# EAGLE design car2r0 (EAGLE 7.7.0)
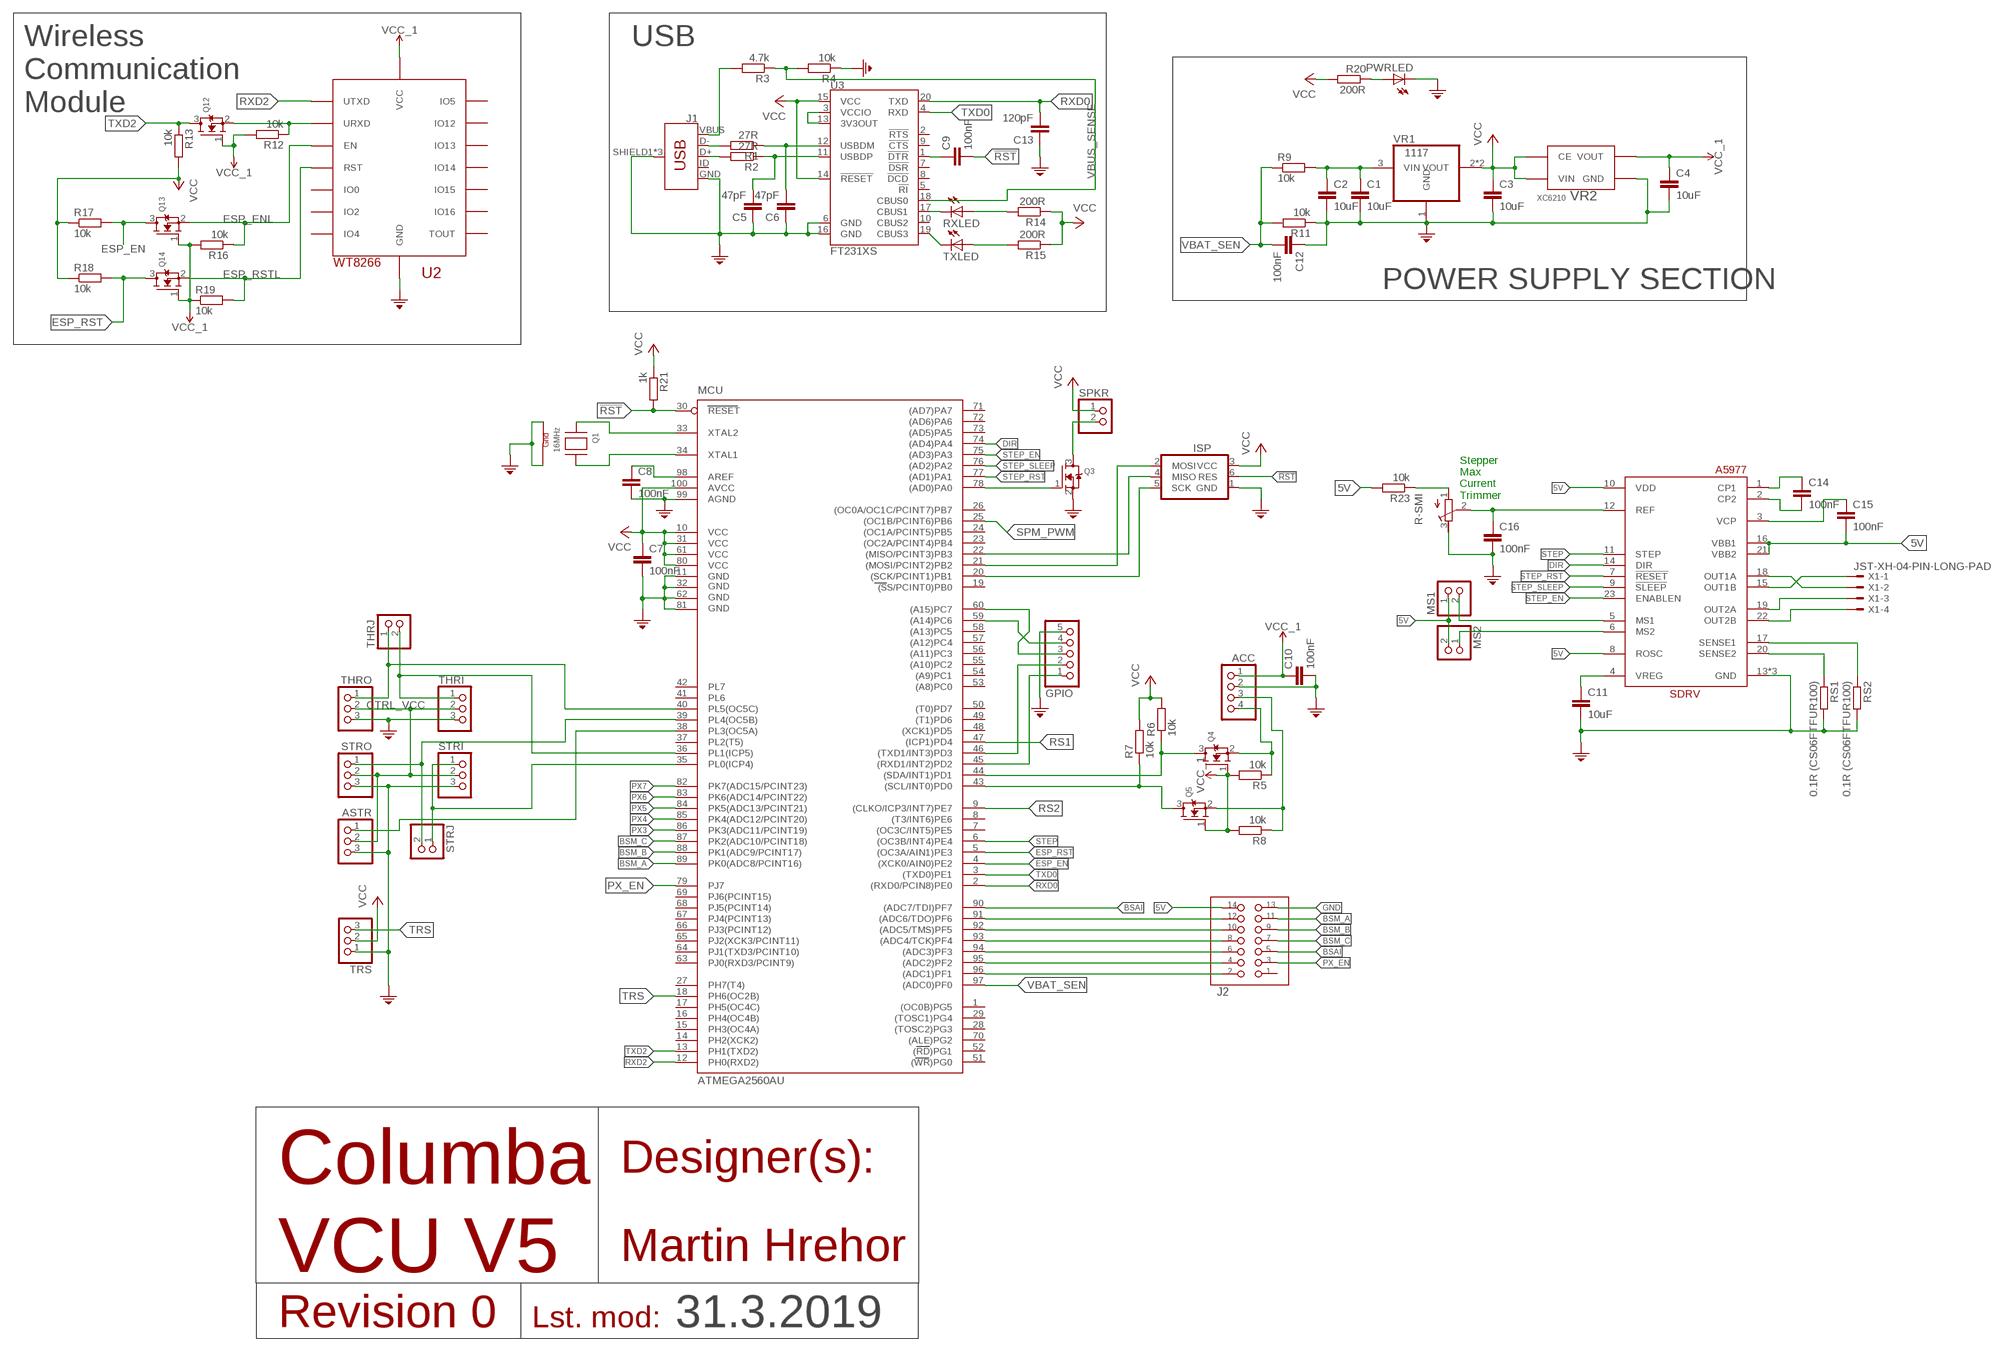
[diagram p0: schematic, sheet 1]

## Parts
ACC  PINHD-1X4/90  [1X04/90]
ASTR  PINHD-1X3  [1X03]
C1  10uF  C-EUC1206  [C1206]
C2  10uF  C-EUC1206  [C1206]
C3  10uF  C-EUC1206  [C1206]
C4  10uF  C-EUC1206  [C1206]
C5  47pF  C-EUC0603  [C0603]
C6  47pF  C-EUC0603  [C0603]
C7  100nF  C-EUC1206  [C1206]
C8  100nF  C-EUC1206  [C1206]
C9  100nF  C-EUC1206  [C1206]
C10  100nF  C-EUC1206  [C1206]
C11  10uF  C-EUC1206  [C1206]
C12  100nF  C-EUC1206  [C1206]
C13  120pF  C-EUC0603  [C0603]
C14  100nF  C-EUC1206  [C1206]
C15  100nF  C-EUC1206  [C1206]
C16  100nF  C-EUC1206  [C1206]
GPIO  PINHD-1X5  [1X05]
ISP  ISP  [ISP]
J1  USB_MICRO-B_FEMALE-SMT  [USB-B-MICRO-SMD]
J2  DS1014-14S  [DS1014-14S]
MCU  ATMEGA2560AU  [TQFP100]
MS1  PINHD-1X2  [1X02]
MS2  PINHD-1X2  [1X02]
PWRLED  LEDCHIP-LED0603  [CHIP-LED0603]
Q1  16MHz  XTAL-4-3225  [NX3225]
Q3  MOSFET-NREFLOW  [SOT23]
Q4  MOSFET-NREFLOW  [SOT23]
Q5  MOSFET-NREFLOW  [SOT23]
Q12  MOSFET-NREFLOW  [SOT23]
Q13  MOSFET-NREFLOW  [SOT23]
Q14  MOSFET-NREFLOW  [SOT23]
R1  27R  R-EU_R0603  [R0603]
R2  27R  R-EU_R0603  [R0603]
R3  4.7k  R-EU_R0603  [R0603]
R4  10k  R-EU_R0603  [R0603]
R5  10k  R-EU_R0603  [R0603]
R6  10k  R-EU_R0603  [R0603]
R7  10k  R-EU_R0603  [R0603]
R8  10k  R-EU_R0603  [R0603]
R9  10k  R-EU_R0805  [R0805]
R11  10k  R-EU_R0805  [R0805]
R12  10k  R-EU_R0603  [R0603]
R13  10k  R-EU_R0603  [R0603]
R14  200R  R-EU_R0603  [R0603]
R15  200R  R-EU_R0603  [R0603]
R16  10k  R-EU_R0603  [R0603]
R17  10k  R-EU_R0603  [R0603]
R18  10k  R-EU_R0603  [R0603]
R19  10k  R-EU_R0603  [R0603]
R20  200R  R-EU_R0603  [R0603]
R21  1k  R-EU_R0603  [R0603]
R23  10k  R-EU_R0603  [R0603]
R-SMI  R-TRIMM5W  [RTRIM5W]
RS1  0.1R (CS06FTFUR100)  R-EU_R1206  [R1206]
RS2  0.1R (CS06FTFUR100)  R-EU_R1206  [R1206]
RXLED  LEDCHIP-LED0603  [CHIP-LED0603]
SDRV  A4982LP  [TSSOP24P]
SPKR  PINHD-1X2  [1X02]
STRI  PINHD-1X3  [1X03]
STRJ  PINHD-1X2  [1X02]
STRO  PINHD-1X3  [1X03]
THRI  PINHD-1X3  [1X03]
THRJ  PINHD-1X2  [1X02]
THRO  PINHD-1X3  [1X03]
TRS  PINHD-1X3  [1X03]
TXLED  LEDCHIP-LED0603  [CHIP-LED0603]
U2  WT8266  [WT8266]
U3  FT231XS  [SSOP20_L]
VR1  1117  REG1117  [SOT223]
VR2  XC6210  [SOT25]
X1  JST-XH-04-PIN-LONG-PAD  [JST-XH-04-PACKAGE-LONG-PAD]

## Nets
3V3: ACC.1 C4.1 C10.1 Q4.1(G) Q5.1(G) Q12.1(G) Q13.1(G) Q14.1(G) R5.2 R8.2 R12.2 R16.2 R19.1 U2.3V3(VCC) VR2.5(VOUT) ; supply symbol labelled VCC_1
5V: C3.1 C7.1 C15.2 ISP.3(VCC) J2.P$14 MCU.10(VCC) MCU.31(VCC1) MCU.61(VCC2) MCU.80(VCC3) MCU.100(AVCC) MS1.1 MS2.2 R6.2 R7.2 R13.2 R14.1 R15.1 R17.1 R18.1 R20.2 R21.1 R23.2 SDRV.8(ROSC) SDRV.10(VDD) SDRV.16(VBB1) SDRV.21(VBB2) SPKR.1 TRS.2 U3.14(!RESET) U3.15(VCC) VR1.2(VOUT) VR1.4(VOUT) VR2.1(VIN) VR2.3(CE) ; supply symbol labelled VCC
!RST: C9.2 ISP.6(RES) MCU.30(RESET) R21.2
AREF: C8.1 MCU.98(AREF)
ASTR: ASTR.1 MCU.38(PL3(OC5A))
BSA0: J2.P$10 MCU.92((ADC5/TMS)PF5)
BSA1: J2.P$12 MCU.91((ADC6/TDO)PF6)
BSAI: J2.P$5 MCU.90((ADC7/TDI)PF7)
BSM_A: J2.P$11 MCU.89(PK0(ADC8/PCINT16))
BSM_B: J2.P$9 MCU.88(PK1(ADC9/PCINT17))
BSM_C: J2.P$7 MCU.87(PK2(ADC10/PCINT18))
CP1: C14.1 SDRV.1(CP1)
CP2: C14.2 SDRV.2(CP2)
CTRL_VCC: ASTR.2 STRI.2 STRO.2 THRI.2 THRO.2
DIR: MCU.74((AD4)PA4) SDRV.14(DIR)
DTR: C9.1 U3.1(!DTR)
ESP_EN: MCU.4((XCK0/AIN0)PE2) Q13.3(D) R17.2
ESP_ENL: Q13.2(S) R16.1 U2.EN
ESP_RST: MCU.5((OC3A/AIN1)PE3) Q14.3(D) R18.2
ESP_RSTL: Q14.2(S) R19.2 U2.RST
GND: ACC.2 ASTR.3 C1.2 C2.2 C3.2 C4.2 C5.1 C6.1 C7.2 C8.2 C10.2 C11.2 C12.1 C13.1 C16.2 GPIO.5 ISP.1(GND) J1.GND J1.SHIELD1(SHIELD) J1.SHIELD2(SHIELD) J1.SHIELD3(SHIELD) J2.P$13 MCU.11(GND) MCU.32(GND1) MCU.62(GND2) MCU.81(GND3) MCU.99(AGND) PWRLED.C Q1.2(G2) Q1.4(G1) Q3.2(S) R4.1 R11.1 R-SMI.3(E) RS1.2 RS2.2 SDRV.13(GND) SDRV.24(GND) SDRV.PAD(GND) STRI.3 STRO.3 THRI.3 THRO.3 TRS.1 U2.GND0(GND) U2.GND1(GND) U2.GND2(GND) U3.6(GND) U3.16(GND) VR1.1(GND) VR2.2(GND)
LX0: J2.P$2 MCU.96((ADC1)PF1)
LX1: J2.P$4 MCU.95((ADC2)PF2)
LX2: J2.P$6 MCU.94((ADC3)PF3)
LX3: J2.P$8 MCU.93((ADC4/TCK)PF4)
MISO: ISP.4(MISO) MCU.22((MISO/PCINT3)PB3)
MOSI: ISP.2(MOSI) MCU.21((MOSI/PCINT2)PB2)
MS1: MS1.2 SDRV.5(MS1)
MS2: MS2.1 SDRV.6(MS2)
N$1: MCU.33(XTAL2) Q1.1(X1)
N$2: MCU.34(XTAL1) Q1.3(X2)
N$3: GPIO.3 MCU.60((A15)PC7)
N$5: GPIO.2 MCU.46((TXD1/INT3)PD3)
N$6: GPIO.1 MCU.45((RXD1/INT2)PD2)
N$7: PWRLED.A R20.1
N$8: GPIO.4 MCU.59((A14)PC6)
N$10: R15.2 TXLED.A
N$11: R14.2 RXLED.A
OUT1A: SDRV.18(OUT1A) X1.2
OUT1B: SDRV.15(OUT1B) X1.1
OUT2A: SDRV.19(OUT2A) X1.3
OUT2B: SDRV.22(OUT2B) X1.4
PX3: MCU.86(PK3(ADC11/PCINT19))
PX4: MCU.85(PK4(ADC12/PCINT20))
PX5: MCU.84(PK5(ADC13/PCINT21))
PX6: MCU.83(PK6(ADC14/PCINT22))
PX7: MCU.82(PK7(ADC15/PCINT23))
PX_EN: J2.P$3 MCU.79(PJ7)
RS1: MCU.47((ICP1)PD4)
RS2: MCU.9((CLKO/ICP3/INT7)PE7)
RXD0: C13.2 MCU.2((RXD0/PCIN8)PE0) U3.20(TXD)
RXD2: MCU.12(PH0(RXD2)) U2.UTXD
RXLED: RXLED.C U3.17(CBUS1)
SCK: ISP.5(SCK) MCU.20((SCK/PCINT1)PB1)
SCL: MCU.43((SCL/INT0)PD0) Q5.3(D) R7.1
SCLL: ACC.3 Q5.2(S) R8.1
SDA: MCU.44((SDA/INT1)PD1) Q4.3(D) R6.1
SDAL: ACC.4 Q4.2(S) R5.1
SENSE1: RS2.1 SDRV.17(SENSE1)
SENSE2: RS1.1 SDRV.20(SENSE2)
SIV: R23.1 R-SMI.1(A)
SPKR: MCU.78((AD0)PA0) Q3.1(G)
SPKR0: Q3.3(D) SPKR.2
SPM_PWM: MCU.25((OC1B/PCINT6)PB6)
STEP: MCU.6((OC3B/INT4)PE4) SDRV.11(STEP)
STEP_EN: MCU.75((AD3)PA3) SDRV.23(ENABLEN)
STEP_RST: MCU.77((AD1)PA1) SDRV.7(!RESET)
STEP_SLEEP: MCU.76((AD2)PA2) SDRV.9(!SLEEP)
STRI: MCU.35(PL0(ICP4)) STRI.1 STRJ.1
STRO: MCU.39(PL4(OC5B)) STRJ.2 STRO.1
SVREF: C16.1 R-SMI.2(S) SDRV.12(REF)
THRI: MCU.36(PL1(ICP5)) THRI.1 THRJ.2
THRO: MCU.40(PL5(OC5C)) THRJ.1 THRO.1
TRS: MCU.18(PH6(OC2B)) TRS.3
TXD0: MCU.3((TXD0)PE1) U3.4(RXD)
TXD2: MCU.13(PH1(TXD2)) Q12.3(D) R13.1
TXLED: TXLED.C U3.19(CBUS3)
URXD: Q12.2(S) R12.1 U2.URXD
USBD+: J1.D+ R2.2
USBD-: J1.D- R1.2
USBDM: C6.2 R1.1 U3.12(USBDM)
USBDP: C5.2 R2.1 U3.11(USBDP)
VBAT_SEN: C12.2 MCU.97((ADC0)PF0) R9.1 R11.2
VBUS: J1.VBUS R3.2
VBUS_SENSE: R3.1 R4.2 U3.18(CBUS0)
VCCIO: U3.3(VCCIO) U3.13(3V3OUT)
VCP: C15.1 SDRV.3(VCP)
VIN: C1.1 C2.1 R9.2 VR1.3(VIN)
VREG: C11.1 SDRV.4(VREG)
Unconnected: J1.ID J2.P$1 MCU.1((OC0B)PG5) MCU.7((OC3C/INT5)PE5) MCU.8((T3/INT6)PE6) MCU.14(PH2(XCK2)) MCU.15(PH3(OC4A)) MCU.16(PH4(OC4B)) MCU.17(PH5(OC4C)) MCU.19((SS/PCINT0)PB0) MCU.23((OC2A/PCINT4)PB4) MCU.24((OC1A/PCINT5)PB5) MCU.26((OC0A/OC1C/PCINT7)PB7) MCU.27(PH7(T4)) MCU.28((TOSC2)PG3) MCU.29((TOSC1)PG4) MCU.37(PL2(T5)) MCU.41(PL6) MCU.42(PL7) MCU.48((XCK1)PD5) MCU.49((T1)PD6) MCU.50((T0)PD7) MCU.51((WR)PG0) MCU.52((RD)PG1) MCU.53((A8)PC0) MCU.54((A9)PC1) MCU.55((A10)PC2) MCU.56((A11)PC3) MCU.57((A12)PC4) MCU.58((A13)PC5) MCU.63(PJ0(RXD3/PCINT9)) MCU.64(PJ1(TXD3/PCINT10)) MCU.65(PJ2(XCK3/PCINT11)) MCU.66(PJ3(PCINT12)) MCU.67(PJ4(PCINT13)) MCU.68(PJ5(PCINT14)) MCU.69(PJ6(PCINT15)) MCU.70((ALE)PG2) MCU.71((AD7)PA7) MCU.72((AD6)PA6) MCU.73((AD5)PA5) U2.IO0 U2.IO2 U2.IO4 U2.IO5 U2.IO12 U2.IO13 U2.IO14 U2.IO15 U2.IO16 U2.TOUT U3.2(!RTS) U3.5(!RI) U3.7(!DSR) U3.8(!DCD) U3.9(!CTS) U3.10(CBUS2)

## Notes on the sheet
- USB
- Wireless
  Communication
  Module
- POWER SUPPLY SECTION
- Stepper
  Max
  Current
  Trimmer
- Columba | Designer(s):
- VCU V5 | Martin Hrehor
- Revision 0 | Lst. mod: | 31.3.2019

## Library data of the parts
ACC = pinhead:PINHD-1X4: PIN HEADER
ASTR STRI STRO THRI THRO TRS = adafruit:PINHD-1X3: PIN HEADER
C1-C16 = rcl:C-EU: CAPACITOR, European symbol
GPIO = pinhead:PINHD-1X5: PIN HEADER
ISP = custom:ISP
J1 = SparkFun-Connectors:USB_MICRO-B: USB Type Micro-B Connector Male/female and PTH/SMT variants SparkFun Products: SparkFun microB USB Breakout <https://www.sparkfun.com/products/12035> SparkFun USB microB Plug Breakout <https://www.sparkfun.com/products/10031> SparkFun ESP8266 Thing <https://www.sparkfun.com/products/13231>; PROD_ID: CONN-11752
J2 = columba:DS1014-14S
MCU = SparkFun-IC-Microcontroller:ATMEGA2560: Atmel 100-pin 8-bit uC 64/128/256 Kbytes FLASH 4 Kbytes EEPROM 8 Kbytes SRAM 86 General Purpose I/O pins 12-channels16-bit PWM 4 x Serial USARTs 16-channels 10-bit A/D SparkFun Products None.; PROD_ID: IC-10040
MS1 MS2 SPKR STRJ THRJ = pinhead:PINHD-1X2: PIN HEADER
PWRLED RXLED TXLED = adafruit:LED: LED OSRAM: - CHIPLED LG R971, LG N971, LY N971, LG Q971, LY Q971, LO R971, LY R971 LH N974, LH R974 LS Q976, LO Q976, LY Q976 LO Q996 - Hyper CHIPLED LW Q18S LB Q993, LB Q99A, LB R99A - SideLED LS A670, LO A670, LY A670, LG A670, LP A670 LB A673, LV A673, LT A673, LW A673 LH A674 LY A675 LS A676, LA A676, LO A676, LY A676, LW A676 LS A679, LY A679, LG A679 - Hyper Micro SIDELED® LS Y876, LA Y876, LO Y876, LY Y876 LT Y87S - SmartLED LW L88C, LW L88S LB L89C, LB L89S, LG L890 LS L89K, LO L89K, LY L89K LS L896, LA L896, LO L896, LY L896 - TOPLED LS T670, LO T670, LY T670, LG T670, LP T670 LSG T670, LSP T670, LSY T670, LOP T670, LYG T670 LG T671, LOG T671, LSG T671 LB T673, LV T673, LT T673, LW T673 LH T674 LS T676, LA T676, LO T676, LY T676, LB T676, LH T676, LSB T676, LW T676 LB T67C, LV T67C, LT T67C, LS T67K, LO T67K, LY T67K, LW E67C LS E67B, LA E67B, LO E67B, LY E67B, LB E67C, LV E67C, LT E67C LW T67C LS T679, LY T679, LG T679 LS T770, LO T770, LY T770, LG T770, LP T770 LB T773, LV T773, LT T773, LW T773 LH T774 LS E675, LA E675, LY E675, LS T675 LS T776, LA T776, LO T776, LY T776, LB T776 LHGB T686 LT T68C, LB T68C - Hyper Mini TOPLED® LB M676 - Mini TOPLED Santana® LG M470 LS M47K, LO M47K, LY M47K Source: http://www.osram.convergy.de/
Q1 = adafruit:XTAL-4: Classic 4-pin 3.2 x 2.5mm crystal
Q3-Q5 Q12-Q14 = adafruit:MOSFET-N: N-Channel Mosfet 2N7002E - 60V 260mA SOT23 [Digikey: 2N7002ET1GOSTR-ND] - REEL BSH103 - 30V 850mA SOT23 [Digikey: 568-5013-1-ND]
R1-R9 R11-R21 R23 RS1 RS2 = custom:R-EU_: RESISTOR, European symbol
R-SMI = resistor:R-TRIMM: Trimm resistor
SDRV = columba:A4982
U2 = custom:WT8266
U3 = SparkFun-IC-Comms:FT231X: FTDI FT231X Full Speed USB to Full-handshake UART This USB2.0 Full Speed IC offers a compact bridge to full handshake UART interfaces. The device is a UART, capable of operating up to 3MBaud, with low power consumption (8mA). The FT231X includes the complete FT-X series feature set and enables USB to be added into a system design quickly and easily over a UART interface. Datasheet <http://cdn.sparkfun.com/datasheets/Components/General%20IC/DS_FT231X.pdf> SparkFun Products SparkFun RedBoard - Programmed with Arduino <https://www.sparkfun.com/products/12757> (DEV-12757) SparkFun XBee Explorer USB <https://www.sparkfun.com/products/11812> (WRL-11812) SparkFun XBee Explorer Dongle <https://www.sparkfun.com/products/11697> (WRL-11697) SparkFun Blynk Board - ESP8266 <https://www.sparkfun.com/products/13794> (WRL-13794) SparkFun ESP8266 Thing - Dev Board <https://www.sparkfun.com/products/13711> (WRL-13711) SparkFun Block for Intel® Edison - Base <https://www.sparkfun.com/products/13045> (DEV-13045) SparkFun RedStick <https://www.sparkfun.com/products/13741> (DEV-13741) SparkFun Beefy 3 - FTDI Basic Breakout <https://www.sparkfun.com/products/13746> (DEV-13746) SparkFun FT231X Breakout <https://www.sparkfun.com/products/11736> (BOB-11736); PROD_ID: IC-11524
VR1 = burr-brown:REG1117: 800mA and 1A Low Dropout (LDO) Positive Regulator 1.8V, 2.5V, 2.85V, 3.3V, 5V, and Adj; MPN: REG1117; OC_FARNELL: 1097566; OC_NEWARK: 14P6981
VR2 = custom:XC6210
X1 = Rembrandt Electronics - JST XH Connectors v1-0:JST-XH-04-PIN: JST XH Connector 2 Pin Wire to board connector. Pitch: 2,54 mm, (0.100") Number of pins: 4 Created by Rembrandt Electronics www.rembrandtelectronics.com

## Board
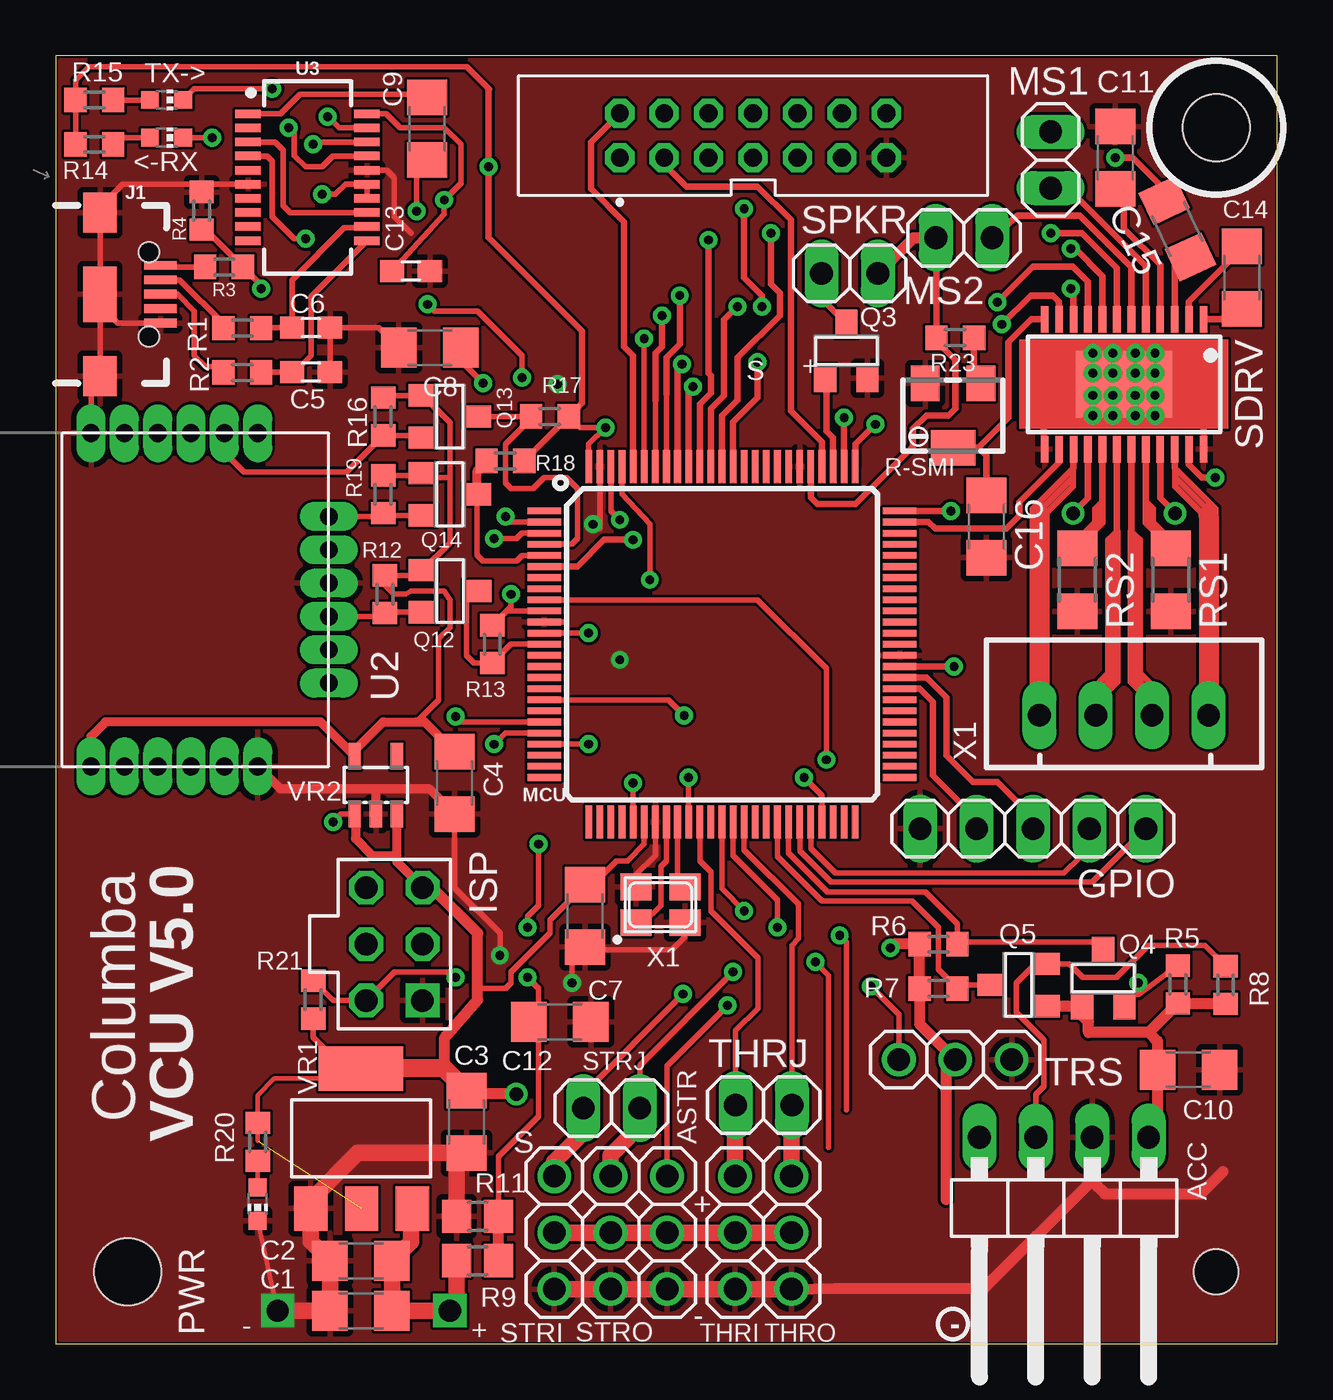
[diagram p1: board, top side]
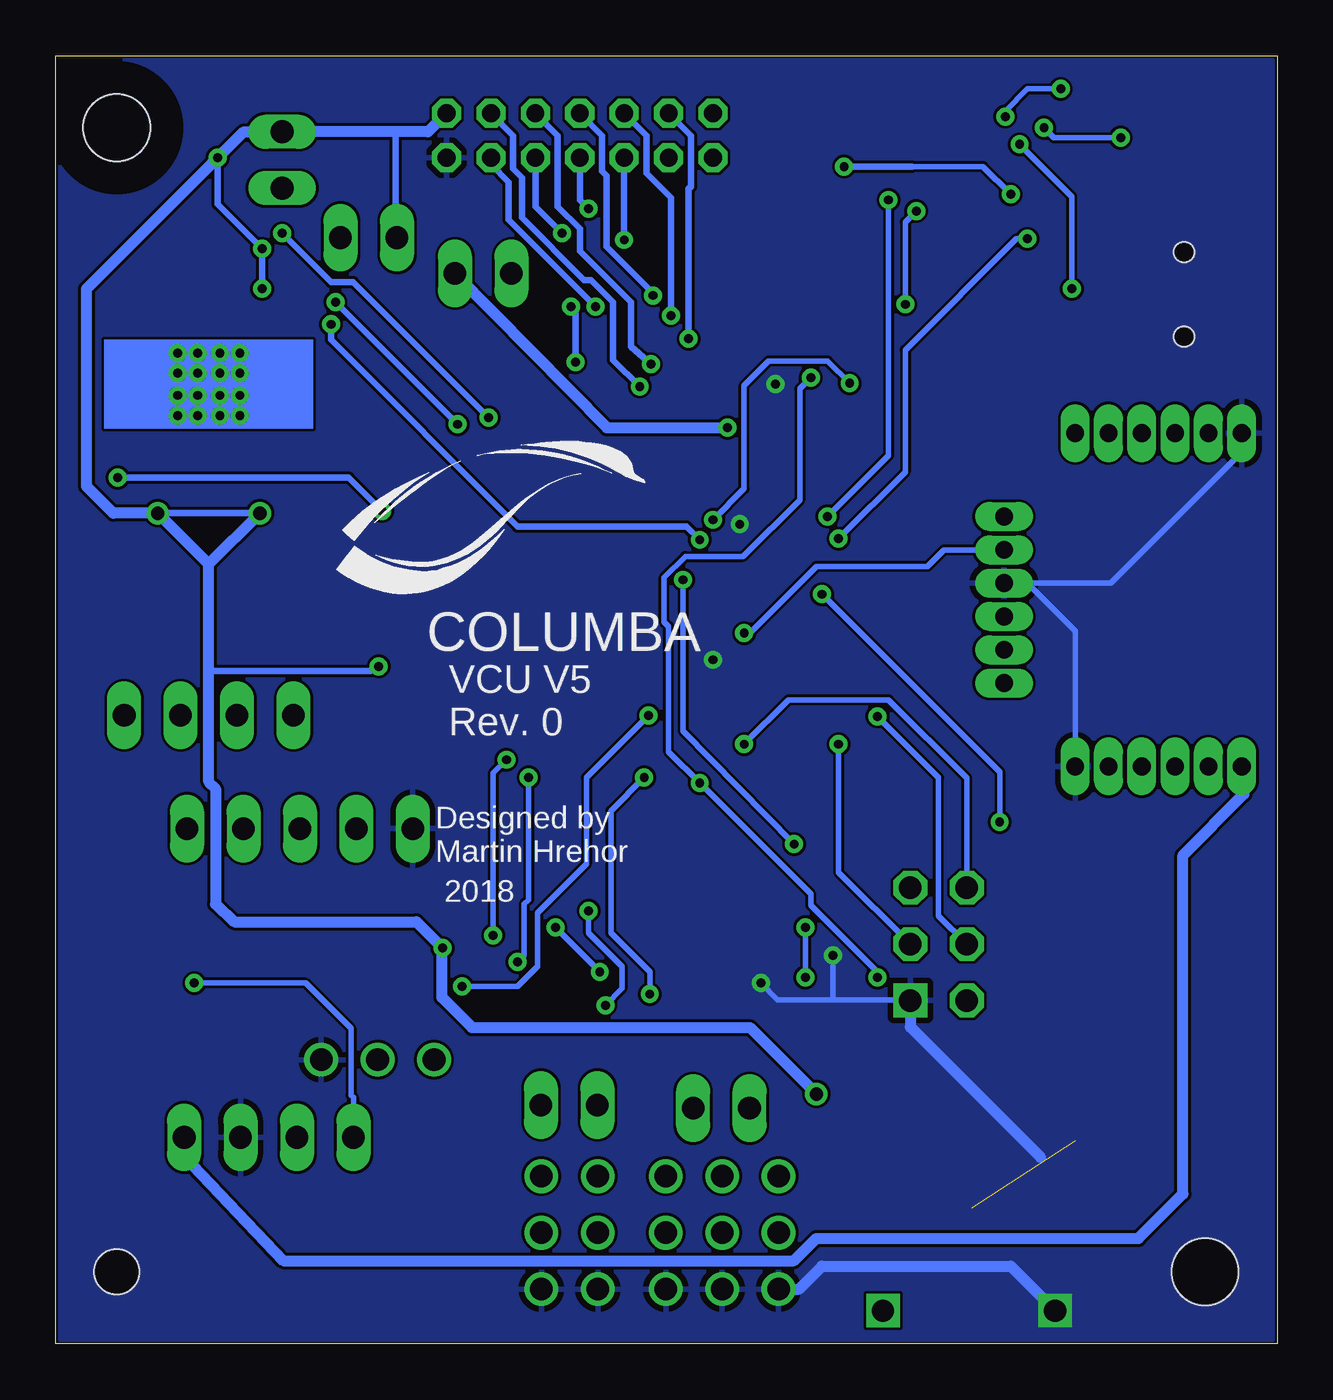
[diagram p2: board, bottom side, seen from below]

Size 55 x 58 mm. Coordinates in mm from the lower left corner, seen from the top.
Outline: 0,0 55,0 55,58 0,58 0,0
Copper layers (1*16): Top 0.035mm / dielectric 1.5mm / Bottom 0.035mm
Design rules "jlcpcb": minimum track width 5mil, minimum drill 0.3mm, track to track 5mil, track to pad 5mil, pad to pad 5mil, via to via 5mil, smd to smd 5mil, copper to edge 0mil, drill to drill 5mil, minimum pad ring 10mil, minimum via ring 8mil, stop-mask expansion 4mil, vias tented up to drill 0mil, thermal gap 10mil
Holes 3 mm at 3.25,3.25 52.25,54.75
Holes 2 mm at 52.25,3.25
tRestrict: area 49.2,51.8 to 55.2,57.8
bRestrict: area 49.2,51.8 to 55.2,57.8

### Footprints (pad centres in the part's own frame; a part is rotated, then mirrored left to right if it is on the bottom)
1X04/90 = drill 1.016 long: 1 -3.81,-3.81; 2 -1.27,-3.81; 3 1.27,-3.81; 4 3.81,-3.81
1X03 = drill 1.016: 1 -2.54,0; 2 0,0; 3 2.54,0
C1206 = smd 1.6 x 1.8: 1 -1.4,0; 2 1.4,0
C0603 = smd 1.1 x 1: 1 -0.85,0; 2 0.85,0
1X05 = drill 1.016 long: 1 -5.08,0; 2 -2.54,0; 3 0,0; 4 2.54,0; 5 5.08,0
ISP = drill 1.016 square: 1 -2.54,-1.27 | drill 1.016 octagon: 2 0,-1.27; 3 2.54,-1.27; 4 2.54,1.27; 5 0,1.27; 6 -2.54,1.27
USB-B-MICRO-SMD = smd 1.45 x 0.4: D+ 2.725,0; D- 2.725,0.65; GND 2.725,-1.3; ID 2.725,-0.65; VBUS 2.725,1.3 | smd 1.5 x 1.8: SHIELD1 0,3.685; SHIELD2 0,-3.685 | smd 1.5 x 2.5: SHIELD3 0,0 | hole 0.9: 2.2,1.9; 2.2,-1.9
DS1014-14S = drill 0.8 pad 1.27 octagon: P$1 6,1; P$2 6,-1; P$3 4,1; P$4 4,-1; P$5 2,1; P$6 2,-1; P$7 0,1; P$8 0,-1; P$9 -2,1; P$10 -2,-1; P$11 -4,1; P$12 -4,-1; P$13 -6,1; P$14 -6,-1
TQFP100 = smd 1.5 x 0.3: 1 -8,6; 2 -8,5.5; 3 -8,5; 4 -8,4.5; 5 -8,4; 6 -8,3.5; 7 -8,3; 8 -8,2.5; 9 -8,2; 10 -8,1.5; 11 -8,1; 12 -8,0.5; 13 -8,0; 14 -8,-0.5; 15 -8,-1; 16 -8,-1.5; 17 -8,-2; 18 -8,-2.5; 19 -8,-3; 20 -8,-3.5; 21 -8,-4; 22 -8,-4.5; 23 -8,-5; 24 -8,-5.5; 25 -8,-6; 51 8,-6; 52 8,-5.5; 53 8,-5; 54 8,-4.5; 55 8,-4; 56 8,-3.5; 57 8,-3; 58 8,-2.5; 59 8,-2; 60 8,-1.5; 61 8,-1; 62 8,-0.5; 63 8,0; 64 8,0.5; 65 8,1; 66 8,1.5; 67 8,2; 68 8,2.5; 69 8,3; 70 8,3.5; 71 8,4; 72 8,4.5; 73 8,5; 74 8,5.5; 75 8,6 | smd 0.3 x 1.5: 26 -6,-8; 27 -5.5,-8; 28 -5,-8; 29 -4.5,-8; 30 -4,-8; 31 -3.5,-8; 32 -3,-8; 33 -2.5,-8; 34 -2,-8; 35 -1.5,-8; 36 -1,-8; 37 -0.5,-8; 38 0,-8; 39 0.5,-8; 40 1,-8; 41 1.5,-8; 42 2,-8; 43 2.5,-8; 44 3,-8; 45 3.5,-8; 46 4,-8; 47 4.5,-8; 48 5,-8; 49 5.5,-8; 50 6,-8; 76 6,8; 77 5.5,8; 78 5,8; 79 4.5,8; 80 4,8; 81 3.5,8; 82 3,8; 83 2.5,8; 84 2,8; 85 1.5,8; 86 1,8; 87 0.5,8; 88 0,8; 89 -0.5,8; 90 -1,8; 91 -1.5,8; 92 -2,8; 93 -2.5,8; 94 -3,8; 95 -3.5,8; 96 -4,8; 97 -4.5,8; 98 -5,8; 99 -5.5,8; 100 -6,8
1X02 = drill 1.016 long: 1 -1.27,0; 2 1.27,0
CHIP-LED0603 = smd 0.8 x 0.8: A 0,-0.75; C 0,0.75
NX3225 = smd 1.4 x 1.2: 1 -1.1,-0.8; 2 1.1,-0.8; 3 1.1,0.8; 4 -1.1,0.8
SOT23 = smd 1 x 1.27: 1 -0.95,-1.227; 2 0.95,-1.227; 3 0,1.227
R0603 = smd 1 x 1.1: 1 -0.85,0; 2 0.85,0
R0805 = smd 1.3 x 1.5: 1 -0.95,0; 2 0.95,0
RTRIM5W = smd 1.3 x 1.6: 1 -1.25,-1.45; 3 1.25,-1.45 | smd 2 x 1.6: 2 0,1.45
R1206 = smd 1.6 x 1.803: 1 -1.422,0; 2 1.422,0
TSSOP24P = smd 0.35 x 1.2: 1 -3.575,-2.925; 2 -2.925,-2.925; 3 -2.275,-2.925; 4 -1.625,-2.925; 5 -0.975,-2.925; 6 -0.325,-2.925; 7 0.325,-2.925; 8 0.975,-2.925; 9 1.625,-2.925; 10 2.275,-2.925; 11 2.925,-2.925; 12 3.575,-2.925; 13 3.575,2.925; 14 2.925,2.925; 15 2.275,2.925; 16 1.625,2.925; 17 0.975,2.925; 18 0.325,2.925; 19 -0.325,2.925; 20 -0.975,2.925; 21 -1.625,2.925; 22 -2.275,2.925; 23 -2.925,2.925; 24 -3.575,2.925 | smd 4.32 x 3: PAD 0,0
WT8266 = drill 0.8 pad 0.9 long: 3V3 -7.5,1.4; EN 7.5,-4.6; GND0 -7.5,-6.1; GND1 0.75,-9.3; GND2 7.5,1.4; IO0 -7.5,-1.6; IO2 -7.5,-3.1; IO4 -7.5,-0.1; IO5 -2.25,-9.3; IO12 7.5,-1.6; IO13 -3.75,-9.3; IO14 7.5,-0.1; IO15 -7.5,-4.6; IO16 7.5,-3.1; RST 3.75,-9.3; TOUT 7.5,-6.1; URXD -0.75,-9.3; UTXD 2.25,-9.3
SSOP20_L = smd 0.381 x 1.143: 1 -2.857,-2.68; 2 -2.223,-2.68; 3 -1.587,-2.68; 4 -0.953,-2.68; 5 -0.318,-2.68; 6 0.318,-2.68; 7 0.953,-2.68; 8 1.587,-2.68; 9 2.223,-2.68; 10 2.857,-2.68; 11 2.857,2.68; 12 2.223,2.68; 13 1.587,2.68; 14 0.953,2.68; 15 0.318,2.68; 16 -0.318,2.68; 17 -0.953,2.68; 18 -1.587,2.68; 19 -2.223,2.68; 20 -2.857,2.68
SOT223 = smd 1.499 x 2.007: 1 -2.261,-3.15; 2 0.025,-3.15; 3 2.311,-3.15 | smd 3.81 x 2.007: 4 0,3.15
SOT25 = smd 0.55 x 1.2: 1 -0.95,-1.3; 2 0,-1.3; 3 0.95,-1.3; 4 0.95,1.3; 5 -0.95,1.3
JST-XH-04-PACKAGE-LONG-PAD = drill 1.016 long: 1 -3.81,0; 2 -1.27,0; 3 1.27,0; 4 3.81,0

### Placement (x,y rotation side)
ACC  45.4,5.49 180 top
ASTR  27.53,5.01 270 top
C1  13.75,1.5 180 top
C2  13.75,3.75 180 top
C3  18.5,10 270 top
C4  17.96,25.25 270 top
C5  11.5,43.75 180 top
C6  11.5,45.75 180 top
C7  23.83,19.27 270 top
C8  16.85,44.84 180 top
C9  16.73,54.71 270 top
C10  51,12.35 0 top
C11  47.7,53.4 90 top
C12  22.7,14.5 180 top
C13  16,48.3 180 top
C14  53.4,48 90 top
C15  50.5,50.2 115 top
C16  41.9,36.8 270 top
GPIO  44,23.2 180 top
ISP  15.25,18 90 top
J1  2,47.25 0 top
J2  31.4,54.4 180 top
MCU  30,31.5 0 top
MS1  44.8,53.3 270 top
MS2  40.9,49.8 180 top
PWRLED  9.1,6.3 180 top
Q1  27.23,19.77 0 top
Q3  35.6,44.7 0 top
Q4  47.16,16.47 0 top
Q5  43.35,16.16 90 top
Q12  17.76,33.89 270 top
Q13  17.75,41.75 270 top
Q14  17.75,38.25 270 top
R1  8.41,45.73 180 top
R2  8.41,43.73 180 top
R3  7.59,48.48 180 top
R4  6.58,51.01 270 top
R5  50.52,16.18 270 top
R6  39.75,18 180 top
R7  39.75,16 180 top
R8  52.67,16.16 270 top
R9  19,3.75 180 top
R11  19,5.75 0 top
R12  14.83,33.75 90 top
R13  19.66,31.5 90 top
R14  1.75,54 0 top
R15  1.75,56 0 top
R16  14.75,41.75 90 top
R17  22.25,41.75 180 top
R18  20.25,39.75 180 top
R19  14.75,38.25 270 top
R20  9.1,9.1 90 top
R21  11.6,15.5 90 top
R23  40.5,45.3 180 top
R-SMI  40.4,41.8 180 top
RS1  50.2,34.4 270 top
RS2  46,34.4 270 top
RXLED  5,54.3 270 top
SDRV  48.1,43.2 180 top
SPKR  35.75,48.19 180 top
STRI  22.45,5.01 270 top
STRJ  25.03,10.61 0 top
STRO  24.99,5.01 270 top
THRI  30.59,5.01 270 top
THRJ  31.88,10.76 180 top
THRO  33.13,5.01 270 top
TRS  40.5,12.8 180 top
TXLED  5,56 270 top
U2  3,33.5 90 top
U3  11.34,52.52 270 top
VR1  13.75,9.25 0 top
VR2  14.42,25.16 0 top
X1  48.1,28.3 0 top

### Tracks (layer width: path | path; a pad name or v marks a point on that pad's centre or on a via)
3V3
  Top 0.25: R19.1 16.42,39.1 Q14.1 16.8,39.2 17,39 17.75,39 | R16.2 14.85,42.7 Q13.1 17.75,41.47 17.75,39 | 17.75,39 17.75,36.06 Q12.1 16.29,34.6 R12.2 14.83,34.17 15.25,33.75 15.75,33.75 16,33.9 17.5,33.9 17.75,33.5 17.75,32.25 17.25,31.75 17.25,29 16.25,28
  Top 0.4: C4.1 16.61,28 16.25,28 14.75,28 13.47,26.72 VR2.5 11.93,28 2.25,28 1.6,27.35 U2.3V3
  Top 0.5: 49.21,14.02 R5.2 52.65,15.33 R8.2 | Q5.1 46.18,15.21 Q4.1 46.21,14.79 46.5,14.5 46.5,14.02 49.21,14.02 | 49.21,9.78 ACC.1 49.6,9.69 C10.1 49.6,13.63 49.21,14.02
  Bottom 0.5: U2.3V3 1.5,25.9 1.5,24.75 4.25,22 4.25,6.75 6.25,4.75 20.75,4.75 21.75,3.75 44.75,3.75 49.25,8.5 49.25,9.26 ACC.1
5V  (via drill 0.4, 0.4 pad 0.6, 0.6, 0.6 pad 0.8)  (1 unrouted)
  Top 0.2: 9.1,9.15 R20.2 9.1,11.2 9.85,11.95 12.55,11.95
  Top 0.25: MCU.31 26.5,22.5 25.75,21.75 25.25,21.75 24.17,20.67 C7.1 22.25,19.09 22.25,18.5 20.5,16.75 20.5,16.25 20.25,16 19,16 | MCU.100 24,40.5 v24.75,41.25 23.6,41.25 R17.1 R18.1 | R14.1 R15.1 0.9,56.9 1.5,57.5 18.5,57.5 19.51,56.49 | MCU.10 20.31,33 R13.2 20.5,33.19 v20.5,33.75 | v12.5,23.5 12.86,23.86 VR2.1 | v12,51.75 12.6,51.75 13.05,52.2 U3.15 U3.14 | R21.1 11.6,13.8 13.38,12.03
  Top 0.3: MCU.61 v40.45,30.5 | SDRV.16 46.48,38.08 v45.8,37.4 | SDRV.21 49.73,38.08 v50.4,37.4 | SDRV.8 47.12,48.08 45.9,49.3 v45.7,49.3 | v45.7,47.5 45.83,47.38 SDRV.10 | C15.2 49.62,52.28 48.5,53.4 v47.7,53.4 | MS2.2 39.65,49.78 R23.2 39.65,45.15 40.5,44.3 40.5,42.1 40.2,41.8 39.2,41.8 38.6,41.2 38.6,40.4 36,37.8 34.3,37.8 34,38.1 MCU.80 | 19.51,56.49 19.5,56.48 v19.5,53 19.5,49.8 23.7,45.6 23.7,42.35 R17.1
  Top 0.4: ISP.3 15.37,21.69 15.37,22 | 15.37,22 VR2.3 | VR2.1 13.5,23.83 13.5,22.75 14.25,22 15.37,22
  Top 0.5: 17.5,13.75 19,15.5 19,16 19,18.5 16.96,20.54 ISP.3 | v20.75,11.25 18.65,11.25 C3.1 | v37.58,17.82 37.75,18 R6.2 38.9,16.35 39.05,16.2 R7.2 38.9,14.4 TRS.2 40.1,12.4 40.1,6.5 | 17.5,13.75 | 17.5,13.75 17.5,12.4 | 39.65,49.78 38.61,49.78 SPKR.1
  Top 0.75: 13.38,12.03 VR1.4
  Top 0.813: 12.4,11.8 12.55,11.95 13,12.4 VR1.4 17.5,12.4 C3.1
  Bottom 0.25: 25,41.25 v24.75,41.25 | v20.5,33.75 12.5,25.75 v12.5,23.5 | v12,51.75 13.25,53 16.45,53
  Bottom 0.3: v40.45,30.5 40.82,30.3 48,30.3 48.1,30.4 | v50.4,37.4 v45.8,37.4 | v45.7,47.5 v45.7,49.3 47.7,51.3 v47.7,53.4 | MS2.2 39.7,49.87 39.7,54.57 | 16.45,53 v19.5,53
  Bottom 0.5: v20.75,11.25 23.75,14.25 36.25,14.25 37.6,15.6 37.6,17.85 | v37.58,17.82 37.6,17.85 | 37.6,17.85 38.75,19 46.95,19 47.8,19.8 47.8,25 48.1,25.3 48.1,30.4 48.1,35.1 | 48.1,35.1 v45.8,37.4 | 48.1,35.1 v50.4,37.4 52.4,37.4 53.6,38.6 53.6,47.5 v47.7,53.4 46.53,54.57 MS1.1 39.7,54.57 38.23,54.57 J2.P$14 | SPKR.1 30.18,41.25 v24.75,41.25
!RST  (via drill 0.4 pad 0.6)
  Top 0.25: v18,16.5 17.75,16.75 15.27,16.75 ISP.6 12.49,15.46 R21.2 | C9.2 16.25,52.83 v16.25,51 | v16.75,46.8 17.05,46.5 19,46.5 21,44.5 v21,43.5 | v26,25.25 MCU.30
  Bottom 0.25: v18,16.5 18,16.75 21,19.75 21,20.25 v26,25.25 27.4,26.65 27.4,32.3 27.6,32.5 27.6,34.5 26.65,35.45 24.05,35.45 21.5,38 21.5,43 v21,43.5 | v16.25,51 16.75,50.5 v16.75,46.8
AREF  (via drill 0.4 pad 0.6)
  Top 0.25: MCU.98 25,37.5 v25.4,37.1 | v19.25,43.25 18.25,44.25 C8.1
  Bottom 0.25: v25.4,37.1 24,38.5 24,43.15 22.9,44.25 20.25,44.25 v19.25,43.25
ASTR  (via drill 0.4 pad 0.6)
  Top 0.25: v31,19.5 30,20.5 MCU.38 | ASTR.1 27.53,12.53 v30.25,15.25
  Bottom 0.25: v31,19.5 31,18.5 29.5,17 29.5,16 v30.25,15.25
BSA0  (via drill 0.4)
  Top 0.3: MCU.92 28,43.9 v28.2,44.1
  Bottom 0.3: v28.2,44.1 29.1,44.9 29.1,46.9 31.4,49.2 31.4,50.2 32.4,51.2 32.4,54.4 J2.P$10
BSA1  (via drill 0.4)
  Top 0.3: MCU.91 28.5,42.9 v28.7,43.1
  Bottom 0.3: v28.7,43.1 29.9,44.3 29.9,46.9 30.9,47.9 31.2,47.9 34,50.7 34,52.5 34.4,52.9 34.4,54.4 J2.P$12
BSAI  (via drill 0.4)
  Top 0.3: MCU.90 29,42.3 29.5,42.8 29.5,43.6 29.4,43.7 v29.4,49.7
  Bottom 0.3: v29.4,49.7 J2.P$5
BSM_A  (via drill 0.4)
  Top 0.3: MCU.89 29.5,42.1 30.1,42.7 30.1,46.1 v30.7,46.7
  Bottom 0.3: v30.7,46.7 34.6,50.6 34.6,52.3 35.4,53.1 J2.P$11
BSM_B  (via drill 0.4)
  Top 0.3: MCU.88 30,41.8 30.7,42.5 30.7,44.4 32.6,46.3 32.6,47.3 32.2,47.7 v32.2,50
  Bottom 0.3: v32.2,50 33.4,51.2 J2.P$9
BSM_C  (via drill 0.4)
  Top 0.3: MCU.87 30.5,41.5 31.6,42.6 v31.6,44.2 | v31.8,46.7 31.8,47.2 31,48 v31,51.1
  Bottom 0.3: v31.6,44.2 31.6,46.5 v31.8,46.7 | v31,51.1 31.4,51.5 J2.P$7
CP1
  Top 0.3: SDRV.1 52.92,46.12 C14.1
CP2
  Top 0.3: SDRV.2 51.02,46.92 53.4,49.3 C14.2
CTRL_VCC
  Top 0.75: STRI.2 STRO.2 ASTR.2 THRI.2 THRO.2
DIR
  Top 0.3: SDRV.14 45.17,39.67 43.4,37.9 43.4,37.3 42.8,36.7 39.6,36.7 39.3,37 MCU.74
DTR
  Top 0.25: C9.1 16.59,56.25 11,56.25 10.13,55.38 U3.1
ESP_EN
  Top 0.25: Q13.3 R17.2 21.4,41.65 20.25,40.5 20.25,38.75 20.5,38.5 21.5,38.5 22,39 23,39 23.5,38.5 23.5,36.25 23.25,36 MCU.4
ESP_ENL
  Top 0.25: Q13.2 16.42,40.9 R16.1 13.1,39.25 8.5,39.25 7.6,40.15 U2.EN
ESP_RST
  Top 0.25: Q14.3 18.98,35.52 19.25,35.25 20.75,35.25 21,35.5 MCU.5
  Top 0.4: Q14.3 18.98,39.33 R18.2
ESP_RSTL
  Top 0.25: U2.RST 14.6,37.25 R19.2 14.85,37.3 Q14.2
GND  (via drill 0.4, 0.4 pad 0.6, 1)
  Top 0.2: PWRLED.C 10,1.45 v10,1.5 | 51.7,40.5 51.67,40.48 SDRV.24 | SDRV.13 44.5,40.3 44.5,40.7
  Top 0.25: J1.GND 2.8,45.95 2.25,46.5 2.25,47.25 J1.SHIELD3 | U3.16 14.91,52.84 15.25,52.5 15.25,50.75 16,50 | U3.6 6.75,52.2 | 6.75,52.2 3.02,52.2 2,51.19 J1.SHIELD1 J1.SHIELD3 | J1.SHIELD3 J1.SHIELD2 1.6,43.16 U2.GND2 | R4.1 6.75,52.03 6.75,52.2 | C5.1 C6.1 14.54,45.75 C8.2 | MCU.32 27,22 26.13,21.13 Q1.4 25.82,20.57 | 24.25,18.5 24.25,18.29 C7.2 | Q1.2 28.33,18.33 27.75,17.75 23.95,17.75 C7.2 | MCU.99 24.5,36.7 | 23,32.5 MCU.11 | v23.25,16.25 23.25,17.29 C7.2 | C4.2 17.96,20.54 20,18.5 v20,17.5
  Top 0.3: 45.1,41.8 46.7,41.8 SDRV.PAD | 44.5,40.7 44.5,41.5 46.4,41.5 SDRV.PAD | 51.7,40.5 51.7,41.5 49.8,41.5 SDRV.PAD
  Top 0.4: VR2.2 14.42,24.92 14.5,25 | 14.5,25 16.81,25 C4.2 | U2.GND0 10.1,25 14.5,25
  Top 0.5: ACC.2 46.67,7.33 | 46.67,7.33 47.25,6.75 51.55,6.75 52.55,7.75 | THRO.3 35.1,2.5 41.8,2.5 46.65,7.35 46.67,7.33
  Top 0.75: v10,1.5 C1.2 C2.2 11.49,4.61 VR1.1 11.5,5.86 11.5,6.5 13.6,8.6 C3.2 18.05,8.15 R11.1 | STRI.3 STRO.3 ASTR.3 THRI.3 THRO.3
  Bottom 0.25: U2.GND0 9.1,32.1 11.25,34.25 U2.GND1 7.5,34.25 1.6,40.15 U2.GND2 | ISP.1 16.56,15.5 20,15.5 | 20,15.5 22.5,15.5 v23.25,16.25 | v20,17.5 20,15.5
  Bottom 0.5: ISP.1 16.52,14.27 10.65,8.4 | STRI.3 21.53,2.47 20.5,3.5 12,3.5 v10,1.5
  other vias: 24.2,36.9 25.4,30.8 22.6,43.2
  pour Bottom: 0.2,0.2 0.2,57.8 54.8,57.8 54.8,0.2
  pour Top: 0.2,0.2 0.2,57.8 54.8,57.8 54.8,0.2
LX0
  Top 0.3: MCU.96 26,44.5 25.6,44.9 25.6,50.5 24.1,52 24.1,54.1 J2.P$2
LX1  (via drill 0.4)
  Top 0.25: v26.5,45.25 MCU.95
  Bottom 0.3: v26.5,45.25 26.5,52 26.4,52.1 26.4,54.4 J2.P$4
LX2  (via drill 0.4)
  Top 0.25: 27,42.5 MCU.94
  Top 0.3: 27,42.5 27,44.6 27.3,44.9 v27.3,46.3
  Bottom 0.3: v27.3,46.3 27.3,51.6 28.4,52.7 28.4,54.4 J2.P$6
LX3  (via drill 0.4)
  Top 0.25: 27.5,42.75 MCU.93
  Top 0.3: 27.5,42.75 27.5,44.4 28.1,45 v28.1,47.2
  Bottom 0.3: v28.1,47.2 28.1,47.3 30.2,49.4 30.2,52.6 30.4,52.8 30.4,54.4 J2.P$8
MISO  (via drill 0.4 pad 0.6)
  Top 0.25: v24,27 MCU.22
  Bottom 0.25: ISP.4 13.98,25.48 17.5,29 22,29 v24,27
MOSI  (via drill 0.4 pad 0.6)
  Top 0.25: MCU.21 20.25,27.5 v19.75,27
  Bottom 0.25: v19.75,27 19.75,21.23 ISP.2
MS1
  Top 0.3: SDRV.5 49.08,48.52 45.6,52 MS1.2
MS2
  Top 0.3: SDRV.6 48.42,48.48 46.1,50.8 43.3,50.8 MS2.1
N$1
  Top 0.25: Q1.1 26.47,18.97 27.25,19.75 27.25,21.5 27.5,21.75 MCU.33
N$2
  Top 0.25: MCU.34 28,21 28.33,20.67 Q1.3
N$3
  Top 0.3: MCU.60 39.2,30 40.1,29.1 40.1,26.5 41.3,25.3 42.4,25.3 44,23.7 GPIO.3
N$4
  Top 0.3: 49.2,37.6 49.2,37 49.8,36.4
N$5
  Top 0.25: MCU.46 34,22.3 35.1,21.2 45.4,21.2 46.1,21.9 46.54,22.3 GPIO.2
N$6
  Top 0.25: MCU.45 33.5,22.2 34.9,20.8 46.68,20.8 GPIO.1
N$7
  Top 0.2: PWRLED.A R20.1
N$8
  Top 0.3: MCU.59 38.9,29.5 39.5,28.9 39.5,25.6 41.46,23.64 GPIO.4
N$9
  Top 0.3: 47,37.6 47,37 46.4,36.4
N$10
  Top 0.25: R15.2 TXLED.A
N$11
  Top 0.25: R14.2 2.9,54.3 RXLED.A
N$13
  Top 0.3: 50,36.4 49.4,37 49.4,37.6 49.2,37.8
N$14
  Top 0.3: 46.2,36.4 46.8,37 46.8,37.6 47,37.8
N$15  (via drill 0.4)
  other vias: 47.6,42.7
N$16  (via drill 0.4)
  other vias: 47.6,43.7
N$17  (via drill 0.4)
  other vias: 48.6,43.7
N$18  (via drill 0.4)
  other vias: 48.6,42.7
N$19  (via drill 0.4)
  other vias: 46.7,42.7
N$20  (via drill 0.4)
  other vias: 46.7,43.7
N$21  (via drill 0.4)
  other vias: 49.5,43.7
N$22  (via drill 0.4)
  other vias: 49.5,42.7
N$23  (via drill 0.4)
  other vias: 47.6,41.8
N$24  (via drill 0.4)
  other vias: 46.7,41.8
N$25  (via drill 0.4)
  other vias: 48.6,41.8
N$26  (via drill 0.4)
  other vias: 49.5,41.8
N$27  (via drill 0.4)
  other vias: 49.5,44.6
N$28  (via drill 0.4)
  other vias: 48.6,44.6
N$29  (via drill 0.4)
  other vias: 47.6,44.6
N$30  (via drill 0.4)
  other vias: 46.7,44.6
OUT1A
  Top 0.3: X1.2 47.4,28.87 47.4,29.8 | 47.4,29.8 47.4,30.2 | 47.4,30.2 47.4,36.2 47.6,36.4 | 47.6,36.4 47.77,36.58 SDRV.18 | 47.6,36.4 47.6,29.6 | 47.6,29.6 46.8,28.8 | 47.8,36.6 47.8,29.8 47.6,29.6 | 47.4,29.8 46.6,29 | 47.4,30.2 46.6,29.4
OUT1B
  Top 0.3: SDRV.15 45.83,39.42 45.8,39.4 | 45.8,39.4 44.29,37.89 | 44.29,37.89 44.29,37.29 | 45.8,39.4 45.8,39 | 45.8,39 44.2,37.4 | 44.29,37.89 44,37.6 44,37 | 45.8,39 45.8,38.6 44.6,37.4
  Top 0.9: 44.29,37.29 X1.1
OUT2A
  Top 0.3: X1.3 48.8,28.87 48.8,29.8 | 48.8,29.8 48.8,30.2 | 48.8,30.2 48.8,36.2 48.6,36.4 | 48.6,36.4 48.42,36.58 SDRV.19 | 48.6,36.4 48.6,29.6 | 48.6,29.6 49.4,28.8 | 48.4,36.6 48.4,29.8 48.6,29.6 | 48.8,29.8 49.6,29 | 48.8,30.2 49.8,29.2
OUT2B
  Top 0.3: SDRV.22 50.38,39.42 50.4,39.4 | 50.4,39.4 51.91,37.89 | 51.91,37.89 51.91,37.29 | 51.91,37.89 52.2,37.6 52.2,37.2 | 50.4,39.4 50.4,39 | 50.4,39 52,37.4 | 50.4,39 50.4,38.6 51.8,37.2
  Top 0.9: 51.91,37.29 X1.4
PX_EN
  Top 0.3: MCU.79 34.5,40.6 33.1,42 33.1,50.6 31.6,52.1 28.4,52.1 27.4,53.1 J2.P$3
RS1  (via drill 0.4)
  Top 0.25: MCU.47 34.5,24.7 v33.7,25.5 | v34.2,17.2 34.8,16.6 34.8,8.84
  Bottom 0.25: v33.7,25.5 33.7,20 33.9,19.8 33.9,17.5 v34.2,17.2
RS2  (via drill 0.4)
  Top 0.25: MCU.9 31.6,33.5 34.7,30.4 v34.7,26.3 | v35.3,18.4 35.6,18.1 35.6,10.54
  Bottom 0.25: v34.7,26.3 35.3,25.7 v35.3,18.4
RXD0  (via drill 0.4 pad 0.6)
  Top 0.25: U3.20 14.87,55.38 15.5,54.75 17.5,54.75 18.25,54 18.25,52.25 v17.5,51.5 17.5,50.85 C13.2 | v20.25,37.25 20.5,37 MCU.2
  Bottom 0.25: v17.5,51.5 17.5,40 v20.25,37.25
RXD2  (via drill 0.4 pad 0.6)
  Top 0.25: v24,32 MCU.12
  Bottom 0.25: v24,32 23.75,32 20.75,35 15.75,35 15,35.75 U2.UTXD
RXLED  (via drill 0.4 pad 0.6)
  Top 0.25: v7.05,54.3 RXLED.C | U3.17 12.47,53.47 12,53 11.25,53 10.75,53.5 10.75,54.5 v10.5,54.75
  Bottom 0.25: v7.05,54.3 10.05,54.3 v10.5,54.75
SCK  (via drill 0.4 pad 0.6)
  Top 0.25: v18,28.25 18.25,28 MCU.20
  Bottom 0.25: ISP.5 15.25,19.27 15.25,25.5 v18,28.25
SCL
  Top 0.25: Q5.3 40.76,16.16 R7.1 39.75,16.85 39.75,18.75 38.55,19.95 34.5,19.95 32.5,21.95 MCU.43
SCLL
  Top 0.25: R8.1 51.73,17.95 49.2,17.95 47.75,16.5 46.25,16.5 45.64,17.11 Q5.2 44.11,17.11 43.25,16.25 43.25,14.93 44.5,13.68 44.5,11.6 44.13,11.23 ACC.3
SDA
  Top 0.25: Q4.3 46.76,18.1 40.7,18.1 R6.1 40.6,18.9 39.15,20.35 34.75,20.35 33,22.1 MCU.44
SDAL  (via drill 0.4 pad 0.6)
  Top 0.25: v48.75,16.25 48.77,15.73 | 48.77,15.73 R5.1 | Q4.2 48.6,15.73 48.77,15.73
  Bottom 0.25: v48.75,16.25 43.75,16.25 41.7,14.2 41.7,11.2 41.59,11.09 ACC.4
SENSE1
  Top 0.3: SDRV.17 47.12,36.95 RS2.1
SENSE2
  Top 0.3: SDRV.20 49.08,36.95 RS1.1
SIV
  Top 0.3: R23.1 41.35,43.55 R-SMI.1
SPKR
  Top 0.3: MCU.78 35,40.8 34.7,41.1 34.7,43.42 Q3.1
SPKR0
  Top 0.3: Q3.3 34.48,47.05 SPKR.2
STEP  (via drill 0.4)
  Top 0.3: SDRV.11 45.17,46.92 44.9,47.2 43.9,47.2 v42.6,45.9 | v26,36.2 24.7,36.2 23.5,35 MCU.6
  Bottom 0.3: v42.6,45.9 42.6,45.2 34.2,36.8 26.6,36.8 v26,36.2
STEP_EN  (via drill 0.4)
  Top 0.3: SDRV.23 51.02,39.58 51.6,39 v52.2,39 | v40.3,37.5 MCU.75
  Bottom 0.3: v52.2,39 41.8,39 v40.3,37.5
STEP_RST  (via drill 0.4)
  Top 0.3: SDRV.7 47.77,48.42 46.2,50 v44.8,50 | v35.5,41.7 MCU.77
  Bottom 0.3: v35.5,41.7 41.6,47.8 42.6,47.8 v44.8,50
STEP_SLEEP  (via drill 0.4)
  Top 0.3: MCU.76 36,40.5 v36.9,41.4 | SDRV.9 46.48,47.83 45.8,48.5 44,48.5 v42.4,46.9
  Bottom 0.3: v42.4,46.9 v36.9,41.4
STRI  (via drill 0.4 pad 0.6)
  Top 0.25: STRJ.1 23.76,11.26 v28.25,15.75 | v28.5,25.5 MCU.35
  Top 0.75: STRI.1 22.45,8.2 23.75,9.5 STRJ.1
  Bottom 0.25: v28.25,15.75 28.25,16.75 30,18.5 30,24 v28.5,25.5
STRO  (via drill 0.4 pad 0.6)
  Top 0.25: STRJ.2 26.3,12.55 v30.5,16.75 | v32.5,18.75 32.5,20 30.5,22 MCU.39
  Top 0.75: STRO.1 24.99,8.49 26,9.5 26,10.31 STRJ.2
  Bottom 0.25: v30.5,16.75 v32.5,18.75
SVREF
  Top 0.3: SDRV.12 43.92,46.12 42.9,45.1 42.9,41.7 41.55,40.35 | 41.55,40.35 R-SMI.2 | C16.1 41.9,40 41.55,40.35
THRI
  Top 0.25: MCU.36 29,21.75 29.5,21.25 29.5,19.5 31.61,17.39 31.61,15.11 30.61,14.11 THRJ.2
  Top 0.75: THRI.1 30.59,10.84 THRJ.2
THRO
  Top 0.25: MCU.40 31,22.25 33.45,19.8 33.45,18.25 33.15,17.95 THRJ.1
  Top 0.75: THRO.1 33.13,10.84 THRJ.1
TRS  (via drill 0.4)
  Top 0.25: MCU.18 27.6,29 v28.3,28.3 | 37.7,12.8 TRS.3 37.96,14.84 v36.7,16.1
  Bottom 0.25: v36.7,16.1 34.2,16.1 33.3,17 33.3,19.4 31.1,21.6 31.1,25.5 v28.3,28.3
TXD0  (via drill 0.4 pad 0.6)
  Top 0.25: U3.4 9.53,53.47 9.75,53.25 9.75,50.75 10.75,49.75 v11.25,49.75 | v19.75,36.25 20.75,36.25 21,36.5 MCU.3
  Bottom 0.25: v11.25,49.75 11.75,49.75 16.75,44.75 16.75,39.25 v19.75,36.25
TXD2
  Top 0.25: 19.1,33.78 Q12.3 18.5,33.4 18.5,31 18.85,30.65 R13.1 20.51,31.5 MCU.13
TXLED  (via drill 0.4 pad 0.6)
  Top 0.25: TXLED.C 6.25,56.5 v9.75,56.5 | v12.25,55.25 12.76,54.74 U3.19
  Bottom 0.25: 10,56.5 v9.75,56.5 11.25,56.5 12.25,55.5 v12.25,55.25
URXD
  Top 0.25: Q12.2 14.87,32.94 R12.1 14.68,32.75 U2.URXD
USBD+
  Top 0.25: J1.D+ 5.5,47.25 6.25,46.5 6.25,44.5 6.75,44 7.29,44 R2.2
USBD-
  Top 0.25: J1.D- 5.6,47.9 7.56,45.94 R1.2
USBDM
  Top 0.25: R1.1 9.28,45.75 C6.2 10.65,47.9 13,50.25 13.97,50.25 U3.12
USBDP
  Top 0.25: R2.1 9.28,43.75 C5.2 10.75,43.75 11.5,44.5 11.5,47.14 U3.11
VBAT_SEN  (via drill 0.4 pad 0.6)
  Top 0.25: MCU.97 25.5,38.25 26.75,36.9 v26.75,34.4 | R11.2 19.95,8.45 21.75,10.25 21.75,14.5 | v21.75,22.5 21.75,19.75 21.25,19.25 v21.25,18.75 | v21.25,16.5 21.75,16 21.75,14.5 | C12.2 21.75,14.5
  Top 0.5: R9.1 R11.2
  Bottom 0.25: v26.75,34.4 26.75,27.6 v21.75,22.5 | v21.25,18.75 v21.25,16.5
VBUS
  Top 0.25: 6.67,48.8 R3.2 4.79,48.48 J1.VBUS
VBUS_SENSE  (via drill 0.4 pad 0.6)
  Top 0.25: R4.2 6.76,50.16 R3.1 9.25,47.67 v9.25,47.5 | v11.6,54 11.64,54.11 U3.18
  Bottom 0.25: v9.25,47.5 9.25,51.65 v11.6,54
VCCIO
  Top 0.25: U3.3 9.89,54.11 10.25,53.75 10.25,51.25 10.57,50.93 U3.13
VCP
  Top 0.3: SDRV.3 50.38,48.52 C15.1
VIN  (via drill 1)
  Top 0.75: R9.2 18.05,1.8 v17.75,1.5 C1.1 C2.1 16,4.6 16,5.75 16.06,6.06 VR1.3
VREG
  Top 0.3: SDRV.4 49.73,48.58 48.1,50.2 48.1,51.6 C11.1
(copper drawn outside any net)
  shapes: Bottom area x1, Top area x1

### Text on the board
tNames: TX-> | <-RX | + | S | X1 | Columba | VCU V5.0 | S | + | - | - | PWR | - | +
bNames: COLUMBA | VCU V5 / Rev. 0 | Designed by / Martin Hrehor | 2018